# EAGLE design motor_sensor_shieldrouted3 (EAGLE 5.11)
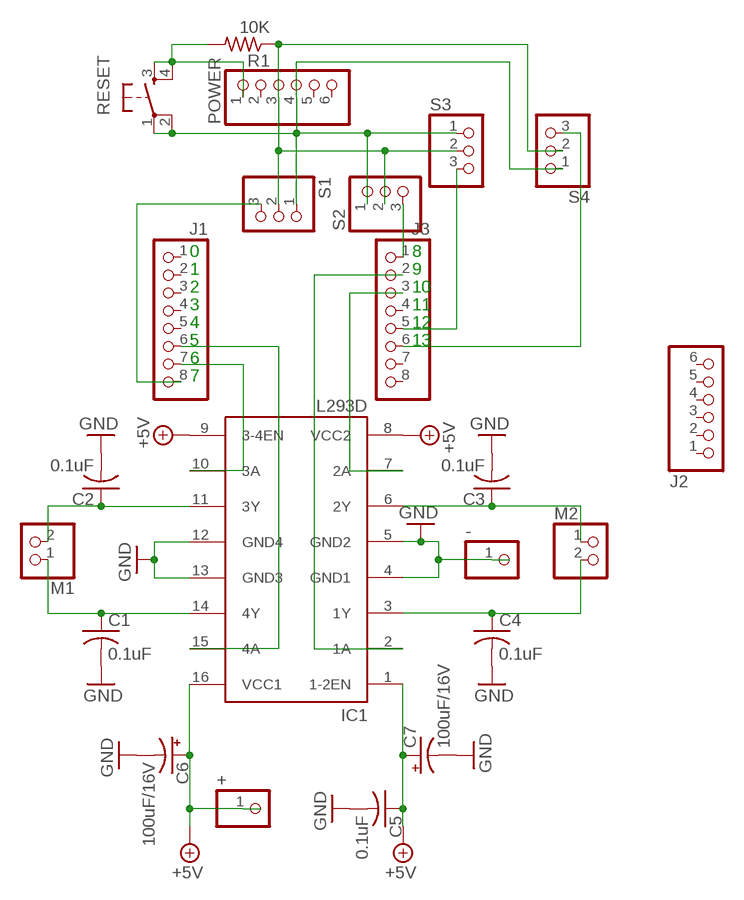
[diagram p0: schematic, sheet 1]

## Parts
+  PINHD-1X1  [1X01]
-  PINHD-1X1  [1X01]
C1  0.1uF  C-US025-024X044  [C025-024X044]
C2  0.1uF  C-US025-024X044  [C025-024X044]
C3  0.1uF  C-US025-024X044  [C025-024X044]
C4  0.1uF  C-US025-024X044  [C025-024X044]
C5  0.1uF  C-US025-024X044  [C025-024X044]
C6  100uF/16V  CPOL-USE3.5-8  [E3,5-8]
C7  100uF/16V  CPOL-USE3.5-8  [E3,5-8]
IC1  L293D  [DIL16]
J1  PINHD-1X8  [1X08]
J2  PINHD-1X6  [1X06]
J3  PINHD-1X8  [1X08]
M1  PINHD-1X2  [1X02]
M2  PINHD-1X2  [1X02]
POWER  PINHD-1X6  [1X06]
R1  10K  R-US_0204/2V  [0204V]
RESET  TAC_SWITCHPTH  [TACTILE-PTH]
S1  PINHD-1X3  [1X03]
S2  PINHD-1X3  [1X03]
S3  PINHD-1X3  [1X03]
S4  PINHD-1X3  [1X03]

## Nets
+5V: +.1 C5.1 C6.+ C7.+ IC1.1(1-2EN) IC1.8(VCC2) IC1.9(3-4EN) IC1.16(VCC1)
GND: -.1 C1.2 C2.2 C3.2 C4.2 C5.2 C6.- C7.- IC1.4(GND1) IC1.5(GND2) IC1.12(GND4) IC1.13(GND3)
N$1: C1.1 IC1.14(4Y) M1.1
N$2: C2.1 IC1.11(3Y) M1.2
N$3: C3.1 IC1.6(2Y) M2.1
N$4: C4.1 IC1.3(1Y) M2.2
N$5: IC1.15(4A) J1.6
N$6: IC1.10(3A) J1.7
N$7: IC1.2(1A) J3.2
N$8: J1.8 S1.3
N$10: J3.1 S2.3
N$11: J3.5 S3.3
N$12: J3.6 S4.3
N$13: IC1.7(2A) J3.3
N$14: POWER.4 RESET.1 RESET.2 S1.1 S2.1 S3.1 S4.1
N$15: POWER.3 R1.1 S1.2 S2.2 S3.2 S4.2
N$16: POWER.1 R1.2 RESET.3 RESET.4
Unconnected: J1.1 J1.2 J1.3 J1.4 J1.5 J2.1 J2.2 J2.3 J2.4 J2.5 J2.6 J3.4 J3.7 J3.8 POWER.2 POWER.5 POWER.6

## Notes on the sheet
- 0 | 8
- 1 | 9
- 2 | 10
- 3 | 11
- 4 | 12
- 5 | 13
- 6
- 7

## Library data of the parts
+ - = pinhead:PINHD-1X1: PIN HEADER
C1-C5 = resistor:C-US: CAPACITOR, American symbol
C6 C7 = resistor:CPOL-US: POLARIZED CAPACITOR, American symbol
IC1 = st-microelectronics:L293D: PUSH-PULL 4 CHANNEL DRIVER; MPN: L293D; OC_FARNELL: 9589619; OC_NEWARK: 56P8249
J1 J3 = pinhead:PINHD-1X8: PIN HEADER
J2 POWER = pinhead:PINHD-1X6: PIN HEADER
M1 M2 = pinhead:PINHD-1X2: PIN HEADER
R1 = resistor:R-US_: RESISTOR, American symbol
RESET = SparkFun:TAC_SWITCH: Momentary Switch Button commonly used for reset or general input. Spark Fun Electronics SKU : COM-00097
S1-S4 = pinhead:PINHD-1X3: PIN HEADER

## Net classes
0 default: width 0.254 mm, drill 0.305 mm, clearance 0.152 mm
1 power: width 0.61 mm, drill 0.508 mm, clearance 0.152 mm
2 gnd: width 0.305 mm, drill 0.508 mm, clearance 0.152 mm
3 usbvcc: width 0.508 mm, drill 0.508 mm, clearance 0.152 mm
4 aref: width 0.406 mm

## Board
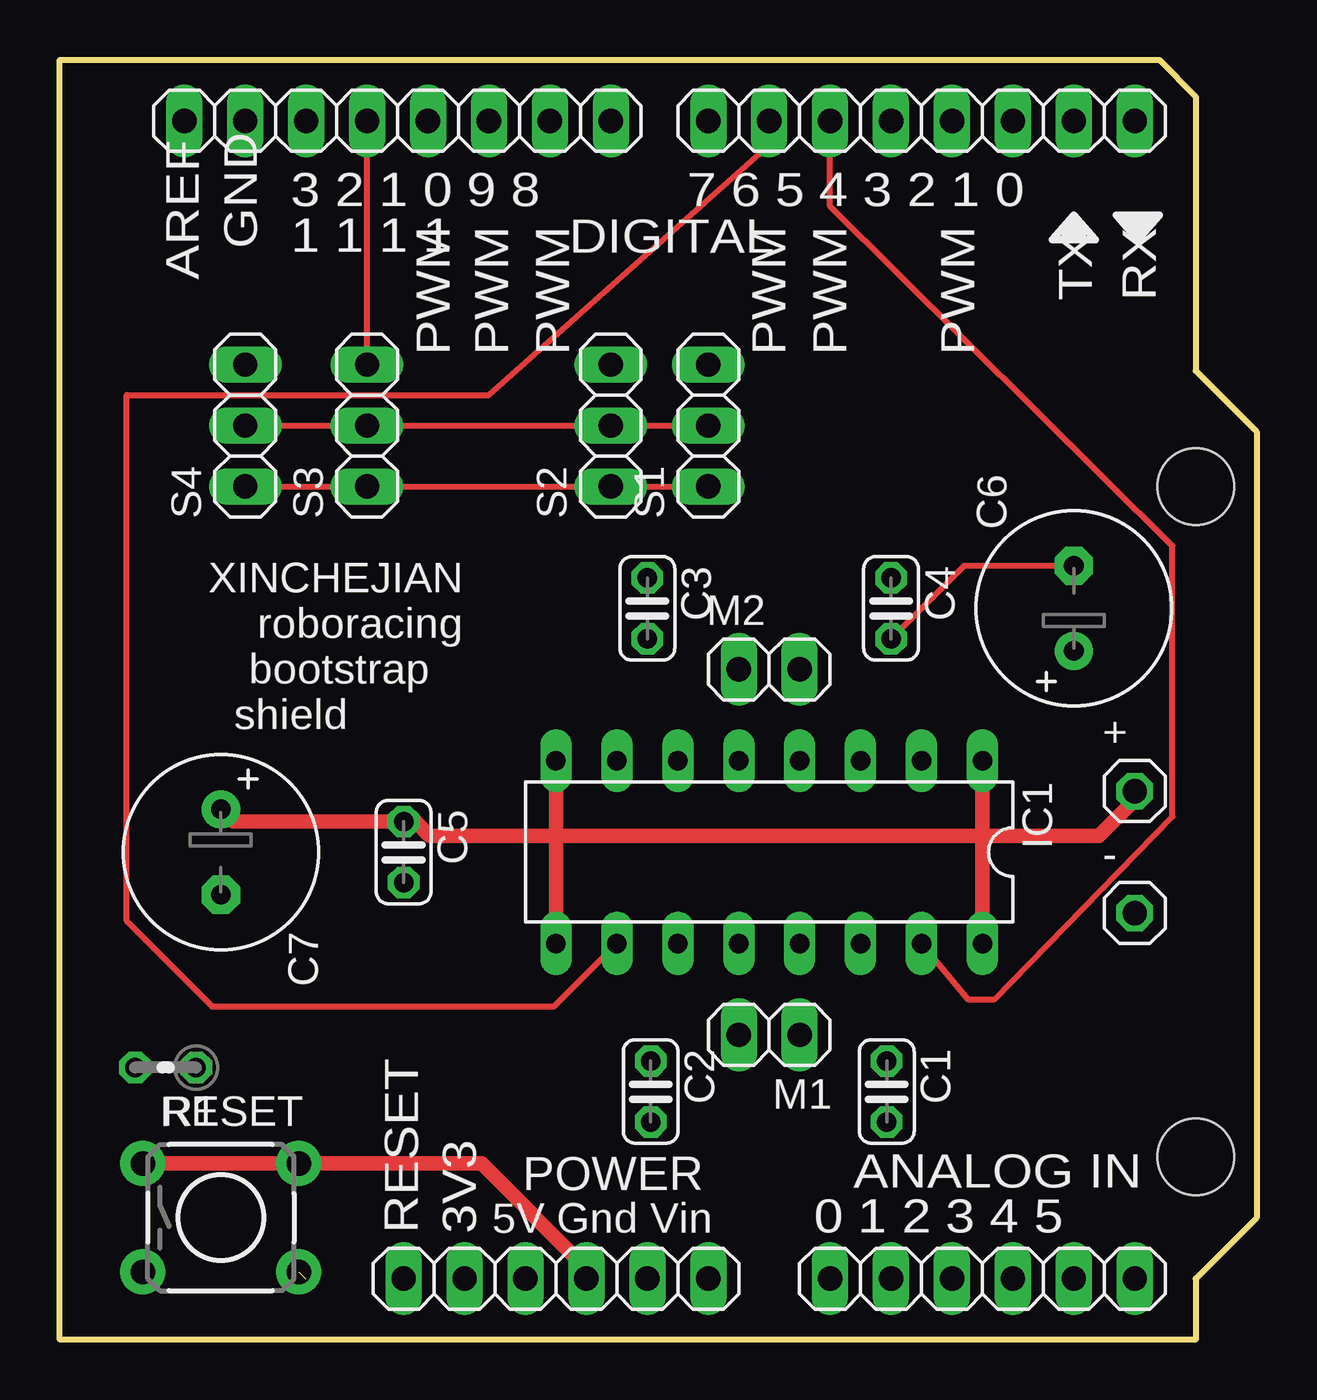
[diagram p1: board, top side]
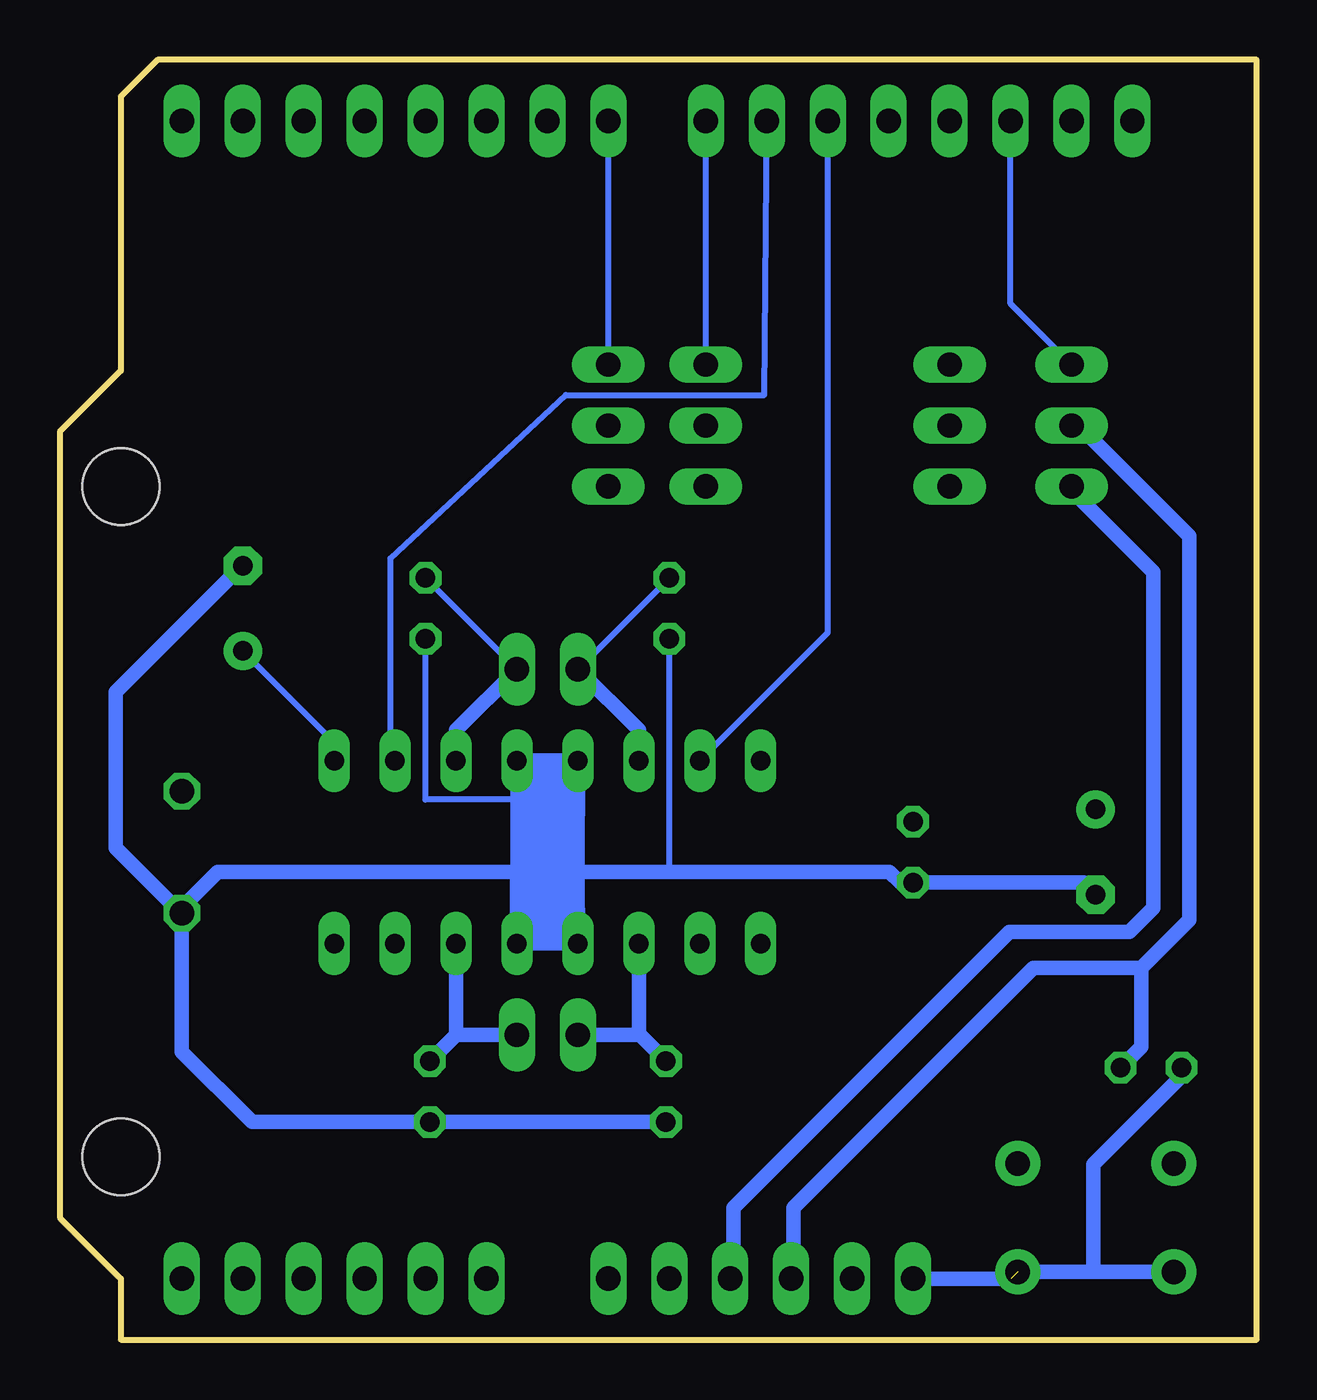
[diagram p2: board, bottom side, seen from below]

Size 49.89 x 53.34 mm. Coordinates in mm from the lower left corner, seen from the top.
Outline: 0,53.34 45.82,53.34 47.35,51.82 47.35,40.39 49.89,37.85 49.89,5.08 47.35,2.54 47.35,0 0,0 0,53.34
Copper layers (1*16): Top 0.035mm / dielectric 1.5mm / Bottom 0.035mm
Design rules "default *": minimum track width 6mil, minimum drill 12mil, track to track 6mil, track to pad 6mil, pad to pad 6mil, via to via 6mil, smd to smd 6mil, copper to edge 30mil, drill to drill 6mil, minimum pad ring 10mil, minimum via ring 10mil, stop-mask expansion 4mil, vias tented up to drill 0mil, thermal gap 10mil
Holes 3.2 mm at 47.35,35.56 47.35,7.62

### Footprints (pad centres in the part's own frame; a part is rotated, then mirrored left to right if it is on the bottom)
1X01 = drill 1.016 octagon: 1 0,0
C025-024X044 = drill 0.813 octagon: 1 -1.27,0; 2 1.27,0
E3,5-8 = drill 0.813 pad 1.6 round: + -1.778,0 | drill 0.813 pad 1.6 octagon: - 1.778,0
DIL16 = drill 0.813 long: 1 -8.89,-3.81; 2 -6.35,-3.81; 3 -3.81,-3.81; 4 -1.27,-3.81; 5 1.27,-3.81; 6 3.81,-3.81; 7 6.35,-3.81; 8 8.89,-3.81; 9 8.89,3.81; 10 6.35,3.81; 11 3.81,3.81; 12 1.27,3.81; 13 -1.27,3.81; 14 -3.81,3.81; 15 -6.35,3.81; 16 -8.89,3.81
1X08 = drill 1.016 long: 1 -8.89,0; 2 -6.35,0; 3 -3.81,0; 4 -1.27,0; 5 1.27,0; 6 3.81,0; 7 6.35,0; 8 8.89,0
1X06 = drill 1.016 long: 1 -6.35,0; 2 -3.81,0; 3 -1.27,0; 4 1.27,0; 5 3.81,0; 6 6.35,0
1X02 = drill 1.016 long: 1 -1.27,0; 2 1.27,0
0204V = drill 0.813 octagon: 1 -1.27,0; 2 1.27,0
TACTILE-PTH = drill 1.016 pad 1.88 round: 1 -3.251,2.261; 2 3.251,2.261; 3 -3.251,-2.261; 4 3.251,-2.261
1X03 = drill 1.016 long: 1 -2.54,0; 2 0,0; 3 2.54,0

### Placement (x,y rotation side)
+  44.81,22.86 0 top
-  44.81,17.78 0 top
C1  34.47,10.34 270 top
C2  24.63,10.34 270 top
C3  24.49,30.48 270 top
C4  34.65,30.48 270 top
C5  14.33,20.32 270 top
C6  42.27,30.48 90 top
C7  6.71,20.32 270 top
IC1  29.57,20.32 180 top
J1  35.92,50.8 180 top
J2  38.46,2.54 0 top
J3  14.07,50.8 180 top
M1  29.57,12.7 180 top
M2  29.57,27.94 0 top
POWER  20.68,2.54 0 top
R1  4.41,11.34 180 top
RESET  6.71,5.08 0 top
S1  27.03,38.1 90 top
S2  22.96,38.1 90 top
S3  12.8,38.1 90 top
S4  7.72,38.1 90 top

### Tracks (layer width: path | path; a pad name or v marks a point on that pad's centre or on a via)
+5V
  Top 0.61: +.1 44.81,22.5 43.31,21 38.46,21 | 20.68,21 38.46,21 | 38.46,21 IC1.1 | 38.46,21 IC1.16 | 20.68,21 IC1.8 | 20.68,21 15.42,21 14.83,21.59 C5.1 7.21,21.59 C7.+ | 20.68,21 IC1.9
  Bottom 0.254: C6.+ 38.46,24.89 IC1.1
GND
  Top 0.254: C4.2 37.69,32.26 C6.-
  Bottom 0.254: 24.49,19.5 C3.2 | C4.2 34.65,22.5 30.81,22.5
  Bottom 0.61: 28.31,19.5 IC1.12 | 28.31,19.5 IC1.12 IC1.13 | 30.84,19.5 IC1.13 | 30.84,19.5 30.81,19.5 | 30.81,19.5 30.81,22.5 30.81,24.5 | C2.2 C1.2 41.88,9.07 44.81,12 44.81,17.75 | 44.81,18 44.81,17.75 | 28.31,19.5 24.49,19.5 15.31,19.5 14.86,19.05 C5.2 7.21,19.05 C7.- | IC1.13 30.81,16.54 30.81,19.5 | 43.31,19.5 30.84,19.5 | 43.31,19.5 44.81,18 | 44.81,17.75 47.56,20.5 47.56,27 42.31,32.25 | 44.81,18 -.1 | 43.31,19.5 44.81,18 | 28.31,19.5 43.31,19.5 | 28.31,19.5 IC1.5 IC1.4
N$1
  Bottom 0.61: 33.38,12.7 IC1.14 | 33.38,12.7 C1.1 | M1.1 33.38,12.7
N$2
  Bottom 0.61: 25.76,12.74 IC1.11 | C2.1 25.76,12.74 | M1.2 25.8,12.7 25.76,12.74
N$3
  Bottom 0.254: M2.1 C3.1
  Bottom 0.61: IC1.6 25.76,25.4 M2.1
N$4
  Bottom 0.254: M2.2 C4.1
  Bottom 0.61: IC1.3 33.38,25.4 M2.2
N$5
  Top 0.254: IC1.15 37.84,14.18 38.96,14.18 46.37,21.8 46.37,33.08 32.11,47.24 J1.6
N$6
  Top 0.254: IC1.10 20.59,13.88 6.34,13.88 2.79,17.44 2.79,39.37 17.88,39.37 29.61,49.8
  Top 0.305: J1.7 29.61,50.76 29.61,49.8
N$7
  Bottom 0.254: IC1.2 36.11,24.54 36.11,32.56 28.79,39.37 20.52,39.37 J3.2
N$8
  Bottom 0.254: S1.3 J1.8
N$10
  Bottom 0.254: S2.3 J3.1
N$11
  Top 0.254: S3.3 J3.5
N$12
  Bottom 0.254: S4.3 10.26,43.18 J3.6
N$13
  Bottom 0.254: IC1.7 17.88,29.46 J3.3
N$14
  Top 0.254: S1.1 S2.1 S3.1 S4.1
  Top 0.61: POWER.4 21.81,2.68 21.81,3.1 17.56,7.34 RESET.2 RESET.1
  Bottom 0.254: S4.1 5.59,33.43
  Bottom 0.61: POWER.4 21.81,2.54 21.81,5.5 10.31,17 5.31,17 4.31,18 4.31,32 7.72,35.42 S4.1
N$15
  Top 0.254: S1.2 S2.2 S3.2 S4.2
  Bottom 0.61: POWER.3 19.31,2.64 19.31,5.5 9.31,15.5 4.81,15.5 | S4.2 7.41,38.1 2.81,33.5 2.81,17.5 4.81,15.5 | R1.1 4.81,12.21 4.81,15.5
N$16  (1 unrouted)
  Bottom 0.61: 10.24,2.54 POWER.1 | RESET.3 6.91,2.82 | 6.91,2.82 RESET.4 | R1.2 3.14,10.97 6.81,7.3 6.81,2.92 6.91,2.82
(copper drawn outside any net)
  shapes: Bottom area x1

### Text on the board
tNames: 3 2 1 0 9 8 | 7 6 5 4 3 2 1 0 | GND | 1 1 1 1 | DIGITAL | AREF | TX | RX | PWM | PWM | PWM | PWM | PWM | PWM | XINCHEJIAN | roboracing | bootstrap | shield | ANALOG IN | RESET | 3V3 | 5V Gnd Vin | 0 1 2 3 4 5